# Altium schematic sheet mcp.SchDoc
size A4
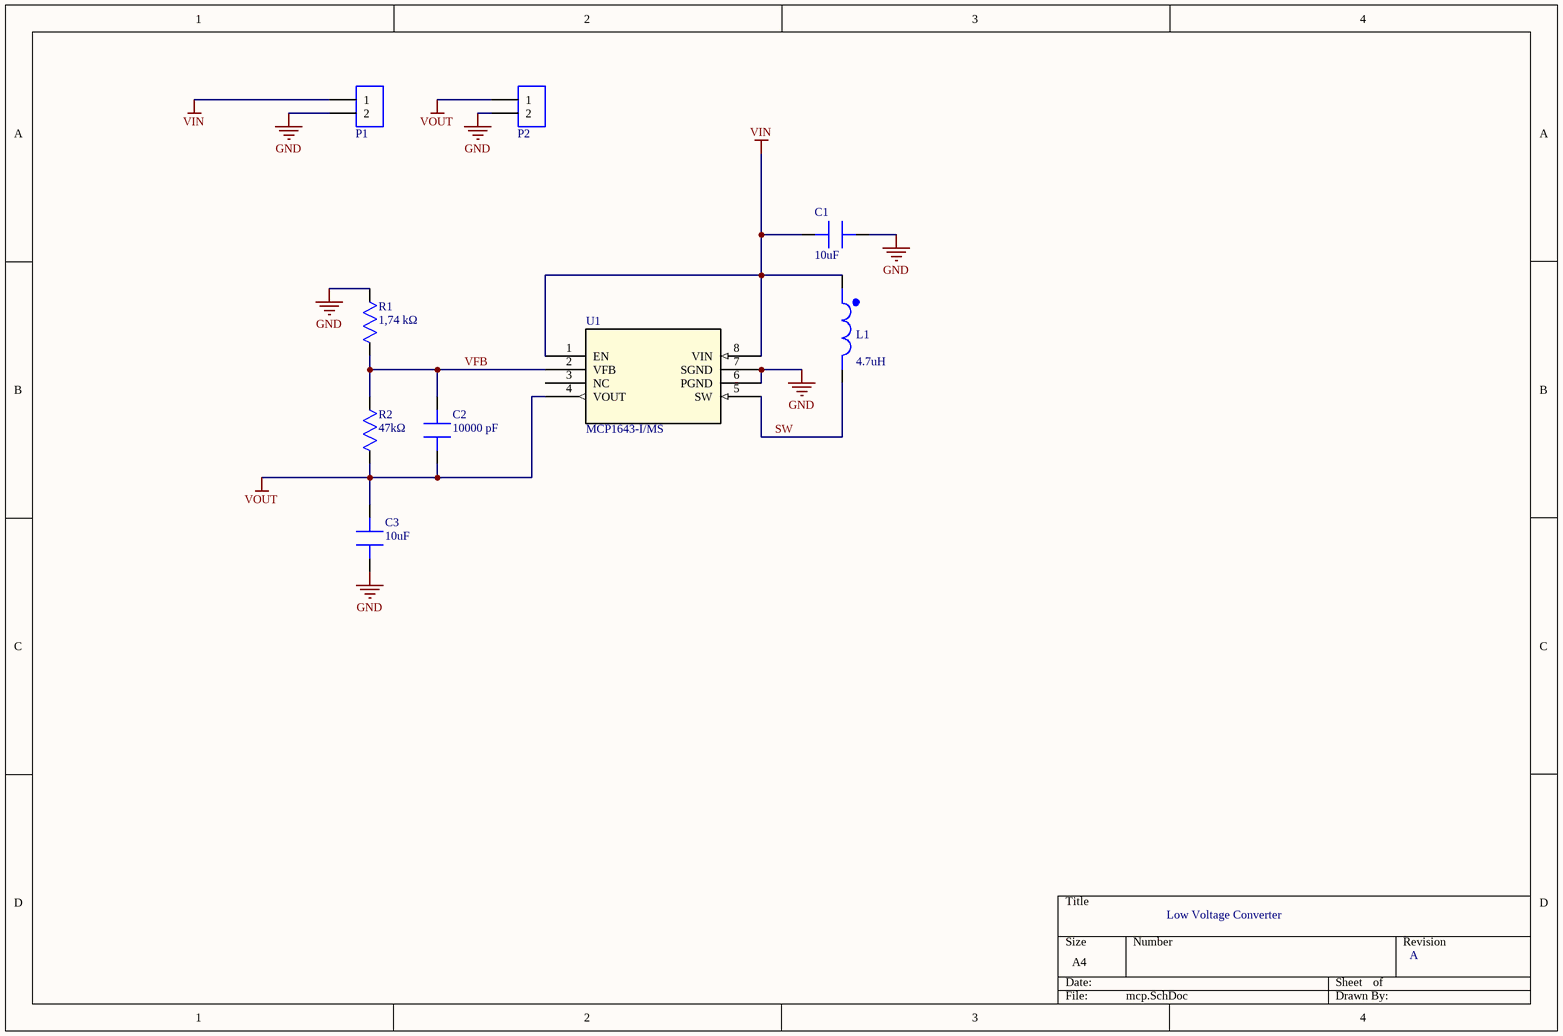
[diagram p0: mcp.SchDoc]

## Parts
C1  10uF  [FB_28C0236-0JW-10]
C2  10000 pF  [CAP_C315_KEM]
C3  10uF  [FB_28C0236-0JW-10]
L1  4.7uH  [INDRD500W70D900H1220]
P1  2x1 terminal block  [OST_OSTTE020104]  (value not drawn)
P2  2x1 terminal block  [OST_OSTTE020104]  (value not drawn)
R1  1,74 kΩ  [RES_MRS25_VIS]
R2  47kΩ  [MOF1WS-47K]
U1  MCP1643-I/MS  [MSOP8_MC_MCH]

## Nets
GND: C1.2 C3.2 P1.2 P2.2 R1.2 U1.6(PGND) U1.7(SGND)
VIN: C1.1(+) L1.1(+) P1.1 U1.1(EN) U1.8(VIN)
VOUT: C2.1 C3.1(+) P2.1 R2.1 U1.4(VOUT)
SW: L1.2(-) U1.5(SW)
VFB: C2.2 R1.1 R2.2 U1.2(VFB)

Not connected (* = marked no-connect by the designer): U1 3(NC)

## Notes on the sheet
- Low Voltage Converter
- A

## Library data of the parts
C1 C3 = TAP106K010CCS: Tantalum Capacitors - Solid Leaded 10V 10uF 10% ESR=5 Ohm; Manufacturer: Kyocera AVX; ESR (Equivalent Series Resistance): 5R; Leakage Current: 800nA; Polarity: Polar; Dissipation Factor: 8%; Life (Hours): 1000Hour; Lead Diameter: 0.5mm; Supplier 1: Digi-Key; Manufacturer Part Number: TAP106K010CCS; RoHS: Yes; Category: Tantalum Capacitors; Stock 1: 1597; Pricing 1: 1=0,75000, 10=0,52800, 50=0,39920, 100=0,34780, 500=0,25760, 1000=0,21896, 2500=0,20608, 5000=0,19320 (USD); Mount: Through Hole; Case/Package: Dipped; Min Operating Temperature: -55°C; Max Operating Temperature: 125°C; Capacitance: 10uF; Package Quantity: 1000; Packaging: Bulk; Voltage Rating: 10V; Tolerance: 10%; Voltage Rating (DC): 10V; Termination: Radial; Features: General Purpose; Series: TAP; Construction: RADIAL; Diameter: 5mm; Length: 10mm; Lead Pitch: 5mm; Height - Seated (Max): 0.394inch; Radiation Hardening: No; Lead Free: Lead Free; RoHS Compliant: Yes; ComponentLink1URL: https://datasheet.ciiva.com/10693/tap-10693337.pdf?src-supplier=Avnet; ComponentLink1Description: https://datasheet.ciiva.com/10693/tap-10693337.pdf?src-supplier=Avnet; ComponentLink2URL: https://datasheet.ciiva.com/15162/getdatasheetpartid-29362-15162954.pdf?src-supplier=Verical; ComponentLink2Description: https://datasheet.ciiva.com/15162/getdatasheetpartid-29362-15162954.pdf?src-supplier=Verical; ComponentLink3URL: https://datasheet.ciiva.com/16493/tap-16493258.pdf?src-supplier=Future+Electronics; ComponentLink3Description: https://datasheet.ciiva.com/16493/tap-16493258.pdf?src-supplier=Future+Electronics; Supplier Part Number 1: 478-9320-ND
C2 = C315C103K5R5TA: 10000 pF ±10% 50V Ceramic Capacitor X7R Radial; Mfr_Name: Kemet; Type: DEV; Copyright: Copyright (C) 2022 Ultra Librarian. All rights reserved.; Manufacturer_Part_Number: C315C103K5R5TA; Digi-Key_Part_Number_1: 399-4148-ND; RefDes: RefDes
L1 = COIL0608-0.0047: Inductor: wire; THT; 4.7uH; Ioper: 5A; 22.94mΩ; ±20%; Ø7.5x9.5mm
P1 P2 = OSTTE020104: 2 Position Wire to Board Terminal Block Horizontal with Board 0.138 _3.50mm_ Through Hole; MF: On Shore; Digi-Key_Purchase_URL: https://www.digikey.com/product-detail/en/on-shore-technology-inc/OSTTE020104/ED2740-ND/2351816?utm_source=snapeda&utm_medium=aggregator&utm_campaign=symbol; Value: *; Package: None; MP: OSTTE020104; Digi-Key_Part_Number: ED2740-ND; SnapEDA_Link: https://www.snapeda.com/parts/OSTTE020104/On%20Shore%20Technology%20Inc./view-part/274621/?ref=snap
R1 = MRS25000C1741FCT00: 1.74 kOhms ±1% 0.6W Through Hole Resistor Axial Metal Film; Mfr_Name: Vishay; Copyright: Copyright (C) 2022 Ultra Librarian. All rights reserved.; Manufacturer_Part_Number: MRS25000C1741FCT00; Digi-Key_Part_Number_1: MRS25000C1741FCT00-ND; Digi-Key_Part_Number_2: 56-MRS25000C1741FCT00CT-ND; Digi-Key_Part_Number_3: 56-MRS25000C1741FCT00TB-ND; RefDes: RefDes; Type: DEV
R2 = MOF1WS-47K: Resistor: metal oxide; THT; 47kΩ; 1W; ±5%; Ø3.2x9mm; axial; Copyright: Copyright (C) 2022 Ultra Librarian. All rights reserved.; Mfr_Name: MOF1WS-47K; Manufacturer_Part_Number: MOF1WS-47K
U1 = MCP1643-I/MS: Switching Voltage Regulators 0.65V-5V input LED Driver; Mfr_Name: Microchip; Copyright: Copyright (C) 2022 Ultra Librarian. All rights reserved.; Manufacturer_Part_Number: MCP1643-I/MS; Digi-Key_Part_Number_1: MCP1643-I/MS-ND; RefDes: RefDes; Type: DEV